# Altium schematic sheet TSI-840523.SchDoc
size A4; SheetNumber: 6; SheetTotal: 10
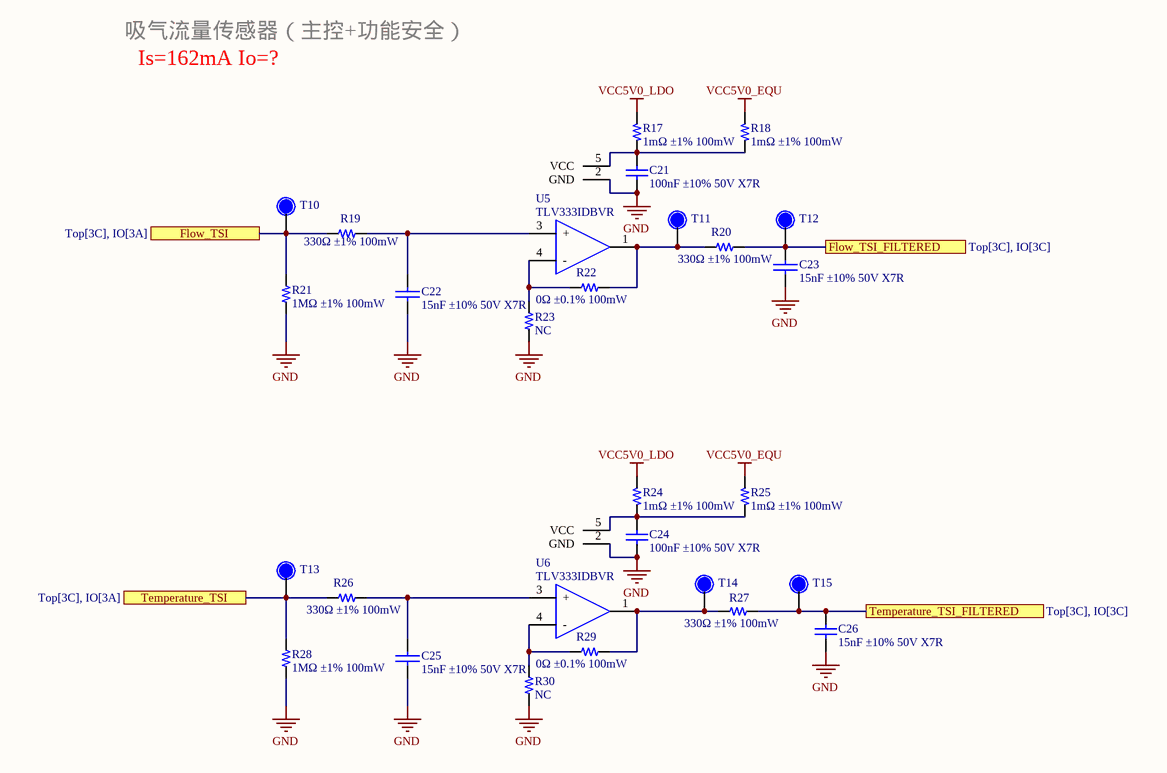
[diagram p0: TSI-840523.SchDoc]

## Parts
C21  100nF ±10% 50V X7R  [C-0603]
C22  15nF ±10% 50V X7R  [C-0603]
C23  15nF ±10% 50V X7R  [C-0603]
C24  100nF ±10% 50V X7R  [C-0603]
C25  15nF ±10% 50V X7R  [C-0603]
C26  15nF ±10% 50V X7R  [C-0603]
R17  1mΩ ±1% 100mW  [R-0603]
R18  1mΩ ±1% 100mW  [R-0603]
R19  330Ω ±1% 100mW  [R-0603]
R20  330Ω ±1% 100mW  [R-0603]
R21  1MΩ ±1% 100mW  [R-0603]
R22  0Ω ±0.1% 100mW  [R-0603]
R23  NC  [R-0603]
R24  1mΩ ±1% 100mW  [R-0603]
R25  1mΩ ±1% 100mW  [R-0603]
R26  330Ω ±1% 100mW  [R-0603]
R27  330Ω ±1% 100mW  [R-0603]
R28  1MΩ ±1% 100mW  [R-0603]
R29  0Ω ±0.1% 100mW  [R-0603]
R30  NC  [R-0603]
T10  Test?  [TestPad_SMD]  (value not drawn)
T11  Test?  [TestPad_SMD]  (value not drawn)
T12  Test?  [TestPad_SMD]  (value not drawn)
T13  Test?  [TestPad_SMD]  (value not drawn)
T14  Test?  [TestPad_SMD]  (value not drawn)
T15  Test?  [TestPad_SMD]  (value not drawn)
U5  TLV333IDBVR  [SOT23-5]
U6  TLV333IDBVR  [SOT23-5]

## Ports
Flow_TSI (see Top[3C], IO[3A]), Flow_TSI_FILTERED (see Top[3C], IO[3C]), Temperature_TSI (see Top[3C], IO[3A]), Temperature_TSI_FILTERED (see Top[3C], IO[3C])

## Nets
GND: C21.1 C22.2 C23.2 C24.1 C25.2 C26.1 R21.2 R23.1(TOP) R28.2 R30.1(TOP) U5.2(GND) U6.2(GND)
VCC5V0_EQU: R18.2(BOT) R25.2(BOT)
VCC5V0_LDO: R17.2(BOT) R24.2(BOT)
Flow_TSI: R19.1(TOP) R21.1 T10.1 ; port Flow_TSI
Flow_TSI_FILTERED: C23.1 R20.2(BOT) T12.1 ; port Flow_TSI_FILTERED
Temperature_TSI: R26.1(TOP) R28.1 T13.1 ; port Temperature_TSI
Temperature_TSI_FILTERED: C26.2 R27.1(TOP) T15.1 ; port Temperature_TSI_FILTERED
NetC21_2: C21.2 R17.1(TOP) R18.1(TOP) U5.5(VCC)
NetC22_1: C22.1 R19.2(BOT) U5.3(+)
NetC24_2: C24.2 R24.1(TOP) R25.1(TOP) U6.5(VCC)
NetC25_1: C25.1 R26.2(BOT) U6.3(+)
NetR20_1: R20.1(TOP) R22.2(BOT) T11.1 U5.1
NetR22_1: R22.1(TOP) R23.2(BOT) U5.4(-)
NetR27_2: R27.2(BOT) R29.2(BOT) T14.1 U6.1
NetR29_1: R29.1(TOP) R30.2(BOT) U6.4(-)

## Notes on the sheet
- 吸气流量传感器（主控+功能安全）
- Is=162mA Io=?

## Library data of the parts
C21 C24 = 100nF_1: 物料编号: 210001894; 详细描述: X7R,50V,三星CL21B104JBCNNNC; 版本: V1.00; 名称: 贴片瓷介电容100nF±5%,0805; 制造商: 三星
C22 C23 C25 = CAP: Capacitor
C26 = C-0603: 物料编号: *; 物料名称: *; 厂家: *; 详细描述: *
R17 R18 R24 R25 = 10K_1: 国巨 / 1mΩ ±1% 100mW; 版本: V1.00; 名称: 贴片电阻10K±1%; 物料编号: 210001830; 详细描述: 0805,1/8W,国巨RC0805FR-0710K; 制造商: 国巨
R19 R20 R26 = 100R-0603: 国巨RC0603FR-07100RL,0603,1/10W; 详细描述: 国巨RC0603FR-07100RL,0603,1/10W,; 制造商: 国巨; 版本: V1.00; 名称: 贴片电阻100R±1%
R21 R28 = R-0603
R22 R23 R29 R30 = 1K_1: 国巨RC0805FR-071K; 物料编号: 210001832; 详细描述: 0805,1/8W,国巨RC0805FR-071K; 制造商: 国巨; 版本: V1.00; 名称: 贴片电阻1K±1%
R27 = 100Ω_1: 国巨RC0805FR-07100R; 物料编号: 210000765; 详细描述: 0805,1/8W,国巨RC0805FR-07100R; 制造商: 国巨; 版本: V1.00; 名称: 贴片电阻100±1%
T10-T15 = TestPad_SMD
U5 U6 = TLV333IDBVR: 品牌：TI，型号：TLV333IDBVR,SOIC-8,–25°~+85°C,单运放，ROHS